# EAGLE design DUAL POWER SUPPLY (EAGLE 9.6.2)
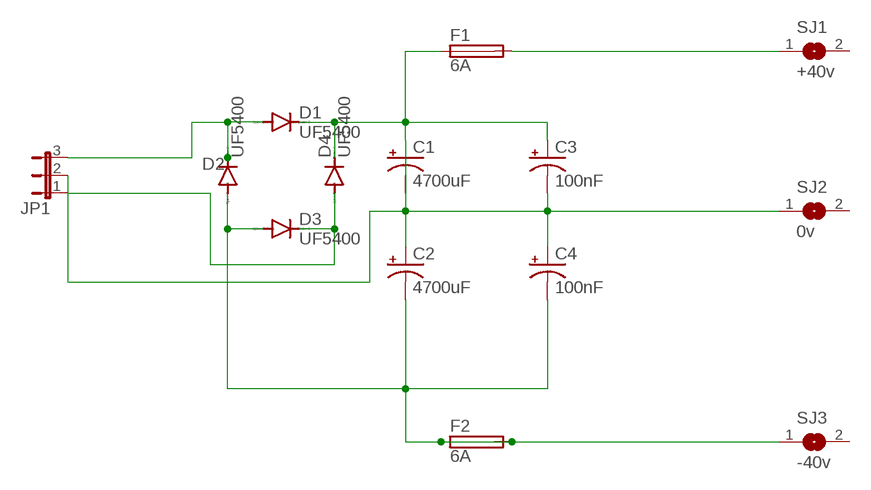
[diagram p0: schematic, sheet 1]

## Parts
C1  4700uF  CPOL-US175TMP-0808  [175TMP-0808]
C2  4700uF  CPOL-US175TMP-0808  [175TMP-0808]
C3  100nF  CPOL-US175TMP-0808  [175TMP-0808]
C4  100nF  CPOL-US175TMP-0808  [175TMP-0808]
D1  UF5400  [DO201-15]
D2  UF5400  [DO201-15]
D3  UF5400  [DO201-15]
D4  UF5400  [DO201-15]
F1  6A  19560  [19560]
F2  6A  19560  [19560]
JP1  JP2W  [JP2W]
SJ1  +40v  SJW  [SJW]
SJ2  0v  SJW  [SJW]
SJ3  -40v  SJW  [SJW]

## Nets
N$1: D1.A D2.C JP1.3
N$2: C2.- C4.- D2.A D3.A F2.1 F2.2 SJ3.1
N$3: F1.2 SJ1.1
N$4: D3.C D4.A JP1.1
N$6: C1.+ C1.- C2.+ C3.+ C3.- C4.+ D1.C D4.C F1.1 JP1.2 SJ2.1
Unconnected: SJ1.2 SJ2.2 SJ3.2

## Library data of the parts
C1-C4 = rcl:CPOL-US: POLARIZED CAPACITOR, American symbol; SPICEPREFIX: C
D1-D4 = diode:UF5400: DIODE ultra fast rectifier, 3 A
F1 F2 = fuse:19560: FUSE HOLDER TR5, Wickmann; MPN: 56000001009; OC_FARNELL: 1185363; OC_NEWARK: 15P8392
JP1 = jumper:JP2W: JUMPER
SJ1-SJ3 = jumper:SJ: SMD solder JUMPER

## Board
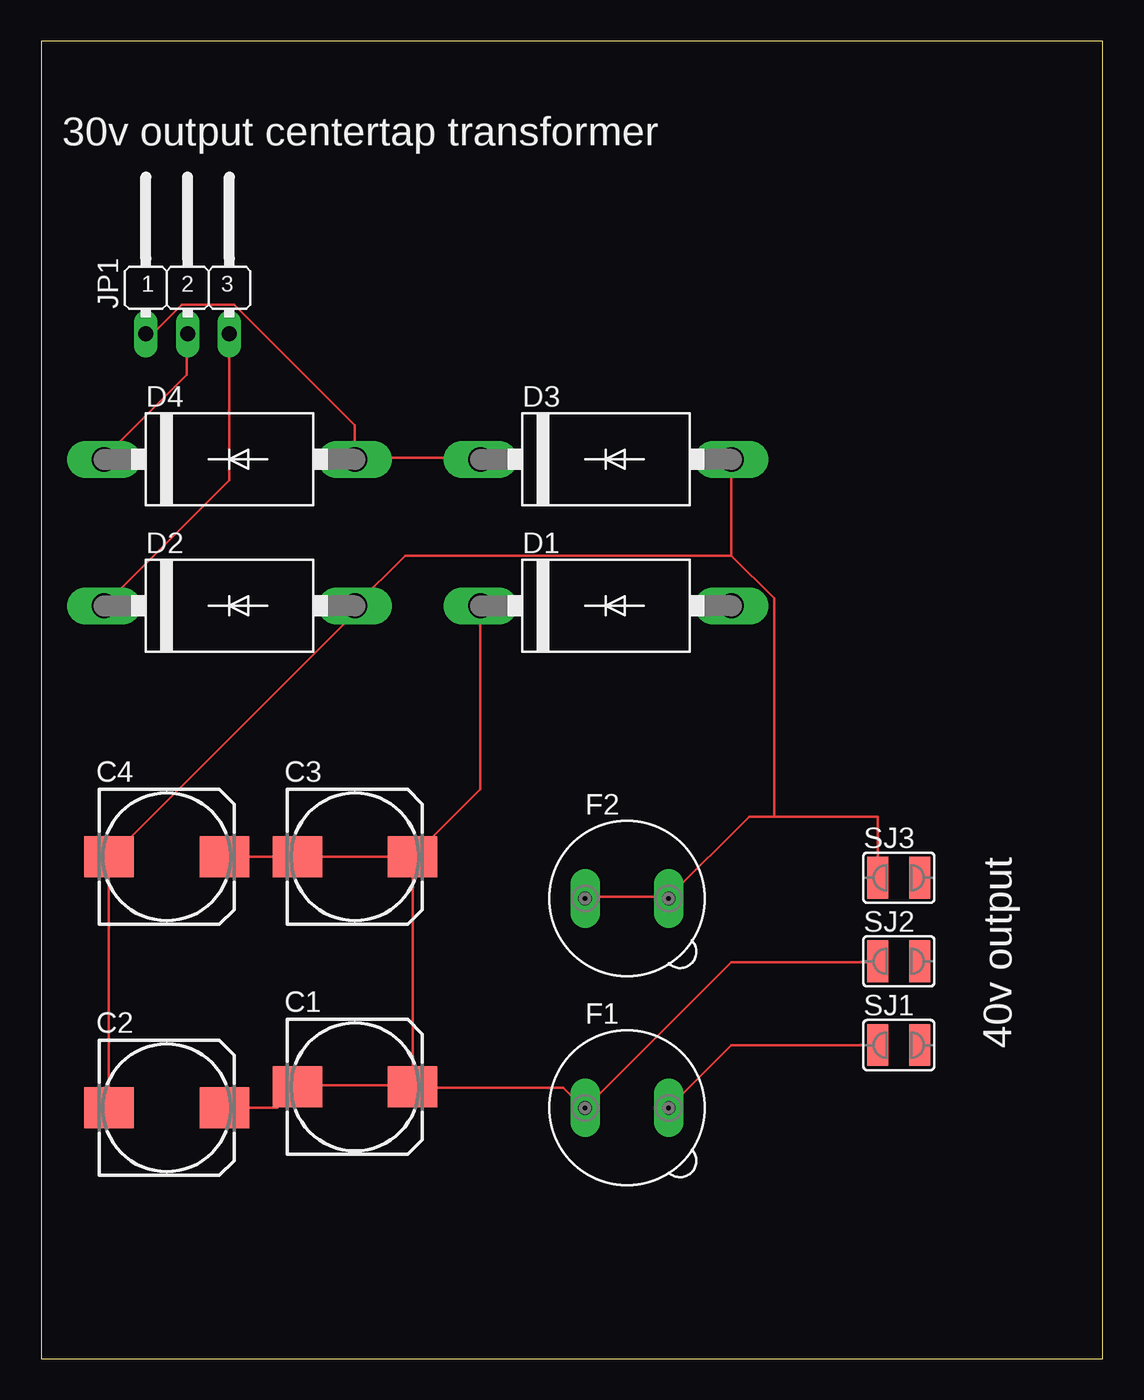
[diagram p1: board, top side]
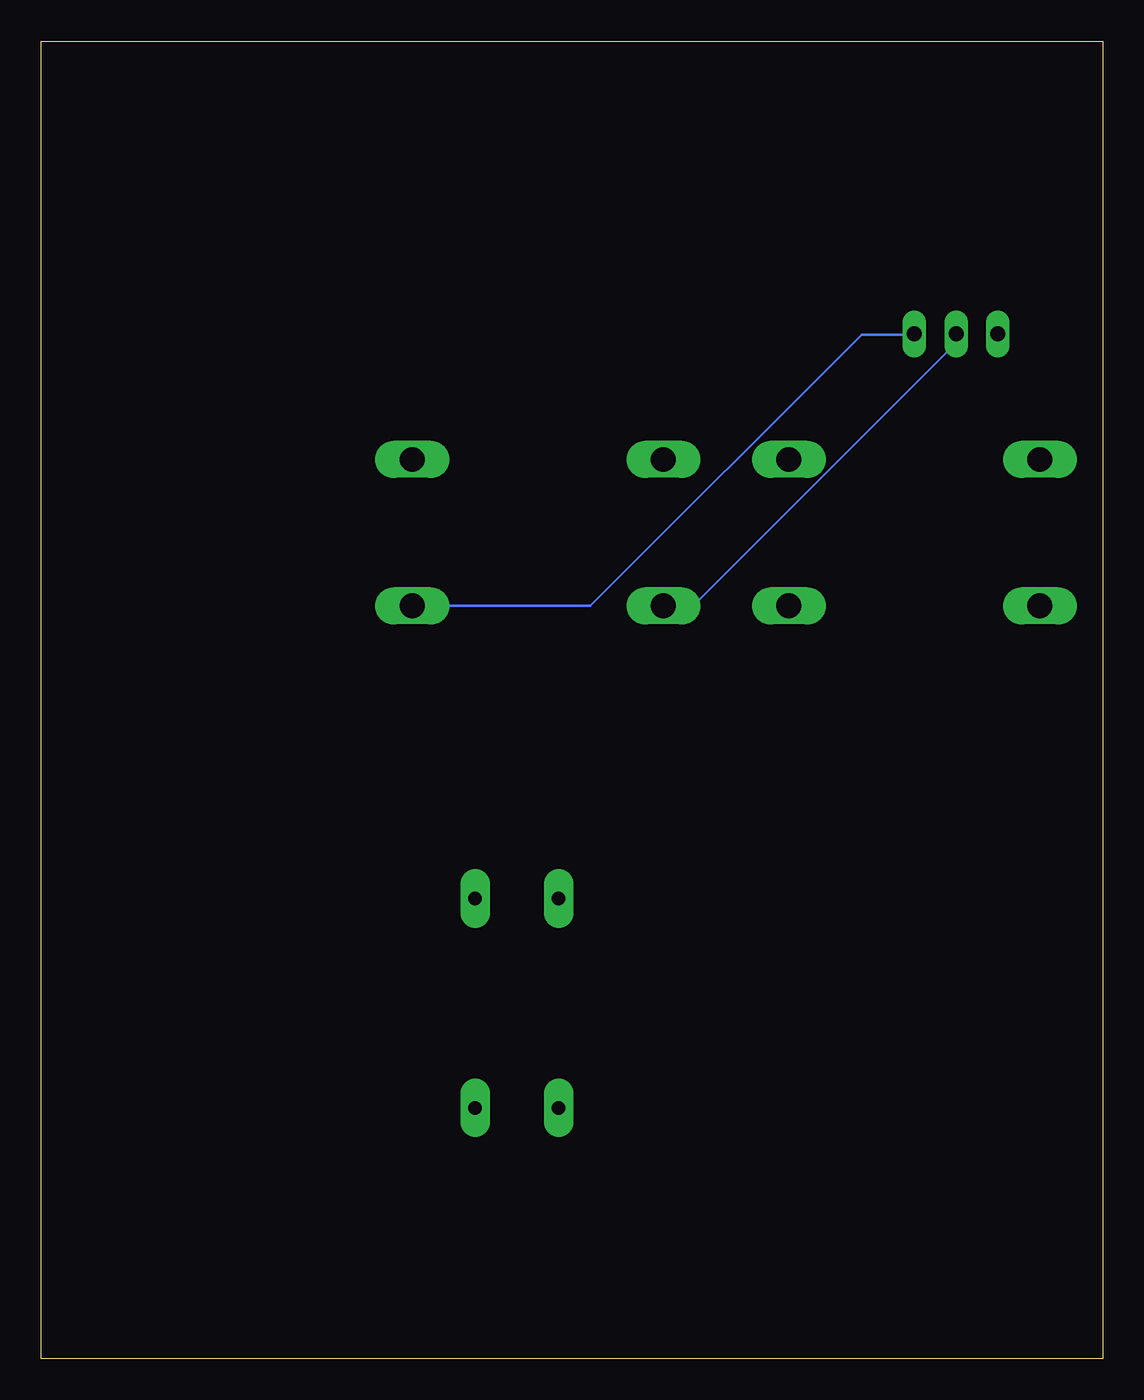
[diagram p2: board, bottom side, seen from below]

Size 64.44 x 80 mm. Coordinates in mm from the lower left corner, seen from the top.
Outline: 0,0 64.44,0 64.44,80 0,80 0,0
Copper layers (1*16): Top 0.035mm / dielectric 1.5mm / Bottom 0.035mm
Design rules "default": minimum track width 6mil, minimum drill 0.35mm, track to track 6mil, track to pad 6mil, pad to pad 6mil, via to via 6mil, smd to smd 6mil, copper to edge 40mil, drill to drill 6mil, minimum pad ring 10mil, minimum via ring 8mil, stop-mask expansion 4mil, vias tented up to drill 0mil, thermal gap 10mil

### Footprints (pad centres in the part's own frame; a part is rotated, then mirrored left to right if it is on the bottom)
175TMP-0808 = smd 3 x 2.5: + 3.5,0; - -3.5,0
DO201-15 = drill 1.499 long: A 7.62,0; C -7.62,0
19560 = drill 0.813 pad 1.778 long: 1 -2.54,0; 2 2.54,0
JP2W = drill 0.914 long: 1 -2.54,-1.27; 2 0,-1.27; 3 2.54,-1.27
SJW = smd 1.27 x 2.54: 1 -1.27,0; 2 1.27,0

### Placement (x,y rotation side)
C1  19.05,16.51 0 top
C2  7.62,15.24 0 top
C3  19.05,30.48 0 top
C4  7.62,30.48 0 top
D1  34.29,45.72 0 top
D2  11.43,45.72 0 top
D3  34.29,54.61 0 top
D4  11.43,54.61 0 top
F1  35.56,15.24 0 top
F2  35.56,27.94 0 top
JP1  8.89,63.5 0 top
SJ1  52.07,19.05 0 top
SJ2  52.07,24.13 0 top
SJ3  52.07,29.21 0 top

### Tracks (layer width: path | path; a pad name or v marks a point on that pad's centre or on a via)
N$1
  Top 0.152: JP1.3 11.43,53.34 D2.C
  Bottom 0.152: D1.A 31.09,45.72 14.63,62.18 11.43,62.18 JP1.3
N$2
  Top 0.152: 44.5,32.92 42.98,32.92 38.1,28.04 | 44.5,32.92 50.8,32.92 SJ3.1 | 38.1,28.04 33.07,28.04 F2.1 | 38.1,28.04 F2.2 | 41.91,48.77 D3.A | 41.91,48.77 44.5,46.18 44.5,32.92 | C2.- C4.- 4.27,30.48 19.05,45.26 D2.A 22.1,48.77 41.91,48.77
N$3
  Top 0.152: SJ1.1 41.91,19.05 F1.2
N$4
  Top 0.152: 19.05,54.71 19.05,56.69 11.73,64.01 8.53,64.01 6.86,62.33 6.4,62.33 JP1.1 | 19.05,54.71 26.67,54.71 D3.C | 19.05,54.71 D4.A
N$6
  Top 0.152: C2.+ 14.33,15.24 15.54,16.46 C1.- 15.7,16.61 22.4,16.61 C1.+ | SJ2.1 50.75,24.08 41.91,24.08 33.07,15.24 F1.1 32.92,15.24 31.7,16.46 22.55,16.46 C1.+ | JP1.2 8.84,62.18 8.84,59.74 3.81,54.71 D4.C | C4.+ C3.- C3.+ | D1.C 26.67,34.59 C3.+ | C3.+ 22.55,16.61 C1.+
  Bottom 0.152: D1.C 24.84,45.72 8.99,61.57 8.99,62.18 JP1.2

### Text on the board
tPlace: 30v output centertap transformer | 40v output